# Altium project fitkit4.PrjPcb (part 2 of 2)

## Sheet mcu_headers.SchDoc
size A4
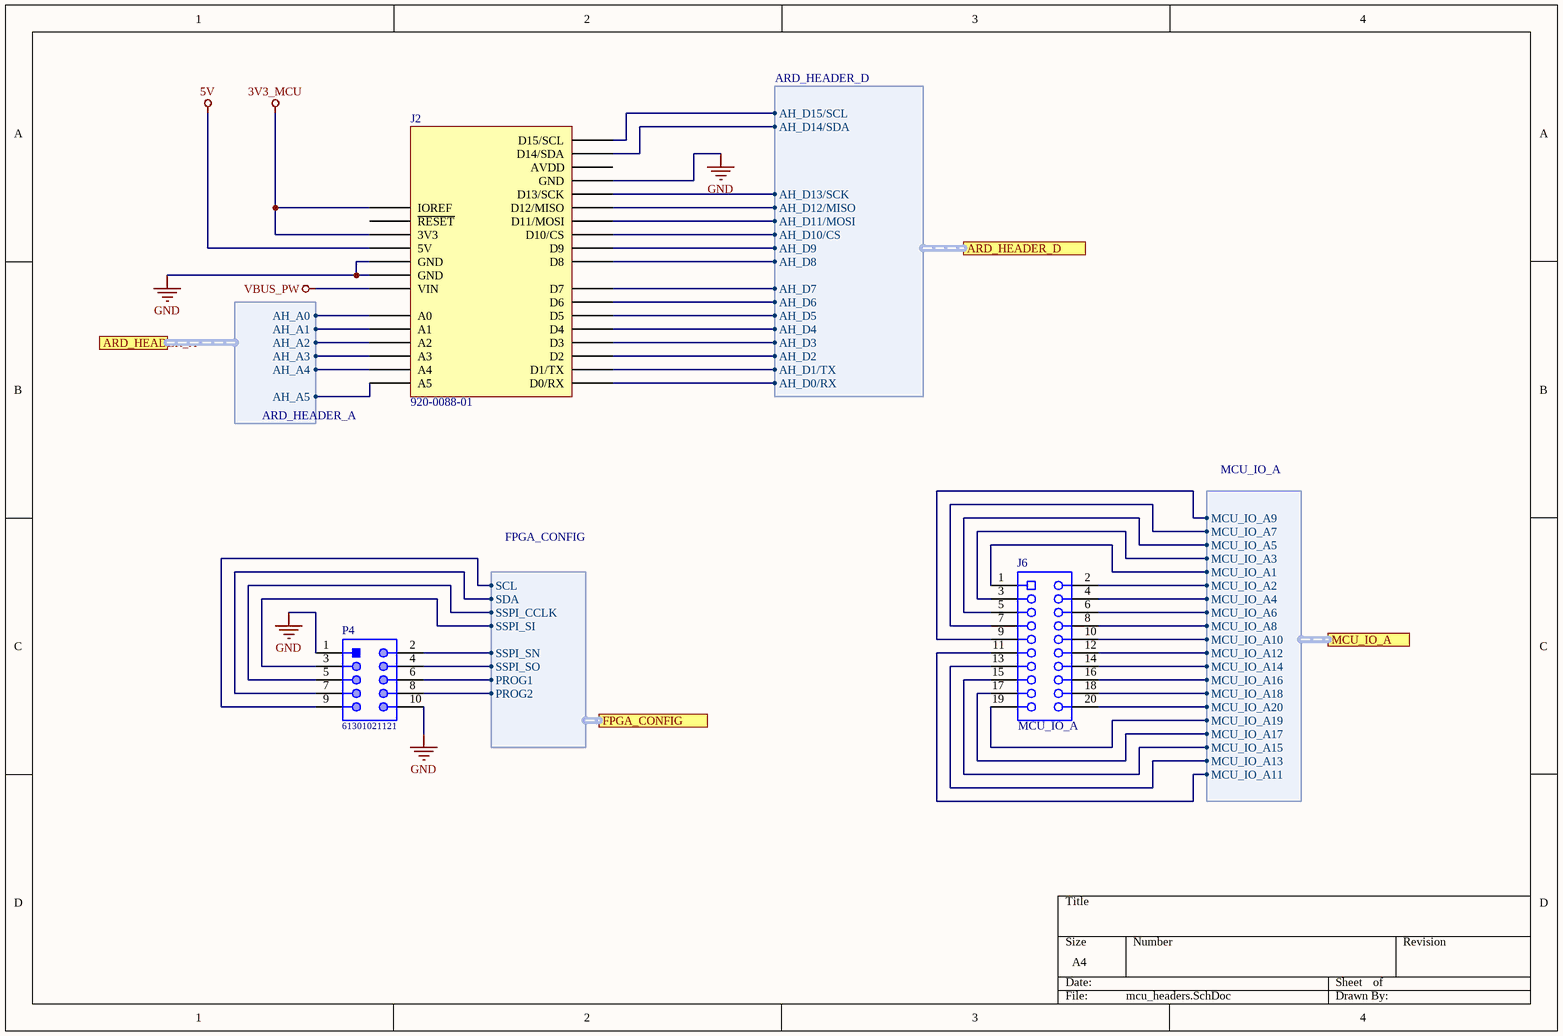
[diagram p5: mcu_headers.SchDoc]

### Parts
J2  920-0088-01  [SCHMARTBOARD - 920-0088-01]
J6  MCU_IO_A  [SLIN-PPPC102LFBN-RC_V]
P4  61301021121  [61301021121]

### Ports
ARD_HEADER_A (harness ARD_HEADER_A), ARD_HEADER_D (harness ARD_HEADER_D), FPGA_CONFIG (harness FPGA_CONFIG), MCU_IO_A (harness MCU_IO_A)

### Harnesses
ARD_HEADER_D: AH_D15/SCL, AH_D14/SDA, AH_D13/SCK, AH_D12/MISO, AH_D11/MOSI, AH_D10/CS, AH_D9, AH_D8, AH_D7, AH_D5, AH_D4, AH_D3, AH_D2, AH_D1/TX, AH_D0/RX, AH_D6
MCU_IO_A: MCU_IO_A9, MCU_IO_A7, MCU_IO_A5, MCU_IO_A3, MCU_IO_A1, MCU_IO_A2, MCU_IO_A4, MCU_IO_A6, MCU_IO_A8, MCU_IO_A10, MCU_IO_A12, MCU_IO_A14, MCU_IO_A16, MCU_IO_A18, MCU_IO_A20, MCU_IO_A19, MCU_IO_A17, MCU_IO_A15, MCU_IO_A13, MCU_IO_A11
FPGA_CONFIG: SSPI_SN, SSPI_SO, PROG1, PROG2, SSPI_SI, SSPI_CCLK, SDA, SCL
ARD_HEADER_A: AH_A0, AH_A1, AH_A2, AH_A3, AH_A4, AH_A5

### Nets
3V3_MCU: J2.2(IOREF) J2.4(3V3)
5V: J2.5(5V) J2.8(VIN)  [also labelled VBUS_PW]
GND: J2.6(GND) J2.7(GND) J2.29(GND) P4.1 P4.10
A10: J6.10 ; port MCU_IO_A.MCU_IO_A10
A11: J6.11 ; port MCU_IO_A.MCU_IO_A11
A12: J6.12 ; port MCU_IO_A.MCU_IO_A12
A13: J6.13 ; port MCU_IO_A.MCU_IO_A13
A14: J6.14 ; port MCU_IO_A.MCU_IO_A14
A15: J6.15 ; port MCU_IO_A.MCU_IO_A15
A16: J6.16 ; port MCU_IO_A.MCU_IO_A16
A17: J6.17 ; port MCU_IO_A.MCU_IO_A17
A18: J6.18 ; port MCU_IO_A.MCU_IO_A18
A19: J6.19 ; port MCU_IO_A.MCU_IO_A19
A20: J6.20 ; port MCU_IO_A.MCU_IO_A20
NetIC1_P2: J2.10(A1) ; port ARD_HEADER_A.AH_A1
NetIC1_P6: J2.9(A0) ; port ARD_HEADER_A.AH_A0
NetIC1_P37: J2.18(D3) ; port ARD_HEADER_D.AH_D3
NetIC1_P57: J2.20(D5) ; port ARD_HEADER_D.AH_D5
NetIC1_P58: J2.21(D6) ; port ARD_HEADER_D.AH_D6
NetIC1_P60: J2.16(D1/TX) ; port ARD_HEADER_D.AH_D1/TX
NetIC1_P61: J2.15(D0/RX) ; port ARD_HEADER_D.AH_D0/RX
NetIC1_P62: J2.22(D7) ; port ARD_HEADER_D.AH_D7
NetIC1_P63: J2.24(D9) ; port ARD_HEADER_D.AH_D9
NetIC1_P64: J2.17(D2) ; port ARD_HEADER_D.AH_D2
NetIC1_P66: J2.19(D4) ; port ARD_HEADER_D.AH_D4
NetIC1_P67: J2.23(D8) ; port ARD_HEADER_D.AH_D8
NetIC1_P68: P4.8 ; port FPGA_CONFIG.PROG2
NetIC1_P69: J6.1 ; port MCU_IO_A.MCU_IO_A1
NetIC1_P70: P4.6 ; port FPGA_CONFIG.PROG1
NetIC1_P72: J6.2 ; port MCU_IO_A.MCU_IO_A2
NetIC1_P75: J6.3 ; port MCU_IO_A.MCU_IO_A3
NetIC1_P81: J6.4 ; port MCU_IO_A.MCU_IO_A4
NetIC1_P84: J6.5 ; port MCU_IO_A.MCU_IO_A5
NetIC1_P87: J6.6 ; port MCU_IO_A.MCU_IO_A6
NetIC1_P88: J6.7 ; port MCU_IO_A.MCU_IO_A7
NetIC1_P91: J6.8 ; port MCU_IO_A.MCU_IO_A8
NetIC1_P92: J2.32(D15/SCL) P4.9 ; port ARD_HEADER_D.AH_D15/SCL, port FPGA_CONFIG.SCL
NetIC1_P93: J2.31(D14/SDA) P4.7 ; port ARD_HEADER_D.AH_D14/SDA, port FPGA_CONFIG.SDA
NetIC1_P95: J6.9 ; port MCU_IO_A.MCU_IO_A9
NetIC1_P114: P4.2 ; port FPGA_CONFIG.SSPI_SN
NetIC1_P116: J2.25(D10/CS) ; port ARD_HEADER_D.AH_D10/CS
NetIC1_P118: J2.28(D13/SCK) P4.5 ; port ARD_HEADER_D.AH_D13/SCK, port FPGA_CONFIG.SSPI_CCLK
NetIC1_P122: J2.27(D12/MISO) P4.4 ; port ARD_HEADER_D.AH_D12/MISO, port FPGA_CONFIG.SSPI_SO
NetIC1_P123: J2.26(D11/MOSI) P4.3 ; port ARD_HEADER_D.AH_D11/MOSI, port FPGA_CONFIG.SSPI_SI
NetIC1_P138: J2.13(A4) ; port ARD_HEADER_A.AH_A4
NetIC1_P139: J2.12(A3) ; port ARD_HEADER_A.AH_A3
NetIC1_P143: J2.11(A2) ; port ARD_HEADER_A.AH_A2
NetIC1_P144: J2.14(A5) ; port ARD_HEADER_A.AH_A5

Not connected (* = marked no-connect by the designer): J2 3(~{RESET}) 30(AVDD)

### Library data of the parts
J2 = 920-0088-01: CONN HDR 8/10P 0.1 GOLD PCB 6PC; Manufacturer: Schmartboard, Inc.; Connector Type: Header; Contact Length - Post: 0.413" (10.50mm); Number of Positions: 6, 8, 10; Number of Positions Loaded: All; Pitch - Mating: 0.100" (2.54mm); Style: Board to Board; Part Number: 920-0088-01; ComponentLink1Description: Datasheet; ComponentLink1URL: http://schmartboard.com/content/Brochures/920-0088-01.pdf; ComponentLink2Description: DigiKey Link; ComponentLink2URL: http://digikey.com/product-detail/en/schmartboard-inc/920-0088-01/1988-1036-ND/9559319; Contact Finish - Mating: Gold; Contact Finish - Post: Gold; Contact Type: Female Socket; Fastening Type: Push-Pull; Insulation Color: Black; Insulation Height: 0.335" (8.51mm); LastUpdated: 31.01.2020 20:49:58; Lifecycle Status: Active; Minimum Order: 1; Mounting Type: Through Hole; Number of Rows: 1; Packaging: Bulk; Part Status: Active; Price: 5.00; Series: -; Supplier 1: DigiKey; Supplier Part Number 1: 1988-1036-ND; Termination: Solder
J6 = CMP-1770-00003-1: Female Header, Pitch 2.54 mm, 2 x 10 Position, Height 8.75 mm, Tail Length 3.2 mm, -40 to 105 degC, RoHS, Bulk; Max Supply Voltage: 16 V; Frequency: 100 KHz; Case\Package: SOIC; Min Supply Voltage: 4.5 V; Max Ouput Current: -200 mA; Package Quantity: 2500; ComponentLink1Description: Datasheet; Min Operating Temperature: 0 degC; Pins: 8; Weight: 0.002561 oz; Radiation Hardening: No; Mount: Surface Mount; Width: 3.91 mm; RoHSCompliant: true; ComponentLink1URL: http://datasheet.octopart.com/PPPC102LFBN-RC-Sullins-datasheet-8327184.pdf; DatasheetVersion: Rev. D, 10/2007; Max Operating Temperature: 70 degC; Height: 1.58 mm; Length: 4.9 mm; PackageReference: PPPC102LFBN-RC; Packaging: Tape and Reel; REACH SVHC: No SVHC; PackageDescription: Female Header, Pitch 2.54 mm, 2 x 10 Position, Height 8.75 mm, Tail Length 3.2 mm
P4 = CMP-1502-01084-1: THT Vertical Pin Header WR-PHD, Pitch 2.54 mm, Dual Row, 10 pins; Manufacturer: Wurth Elektronik; Working Voltage: 250VAC; Pitch: 2.54mm; Contact Resistance: 20mOhm; Gender: Male; Rated Current: 3A; Withstanding Voltage: 500VAC; Pin Number: 10; Operating Temperature: -40to105degC; Mounting Technology: THT; Publisher: WurthElektronik; Manufacturer URL: http://www.we-online.de; Part Number: 61301021121; Row Number: Dual; Packaging: Bag; Orientation: Vertical; Package Reference: 61301021121; Datasheet URL: https://katalog.we-online.de/em/datasheet/6130xx21121.pdf

## Sheet mcu_io.SchDoc
size A4
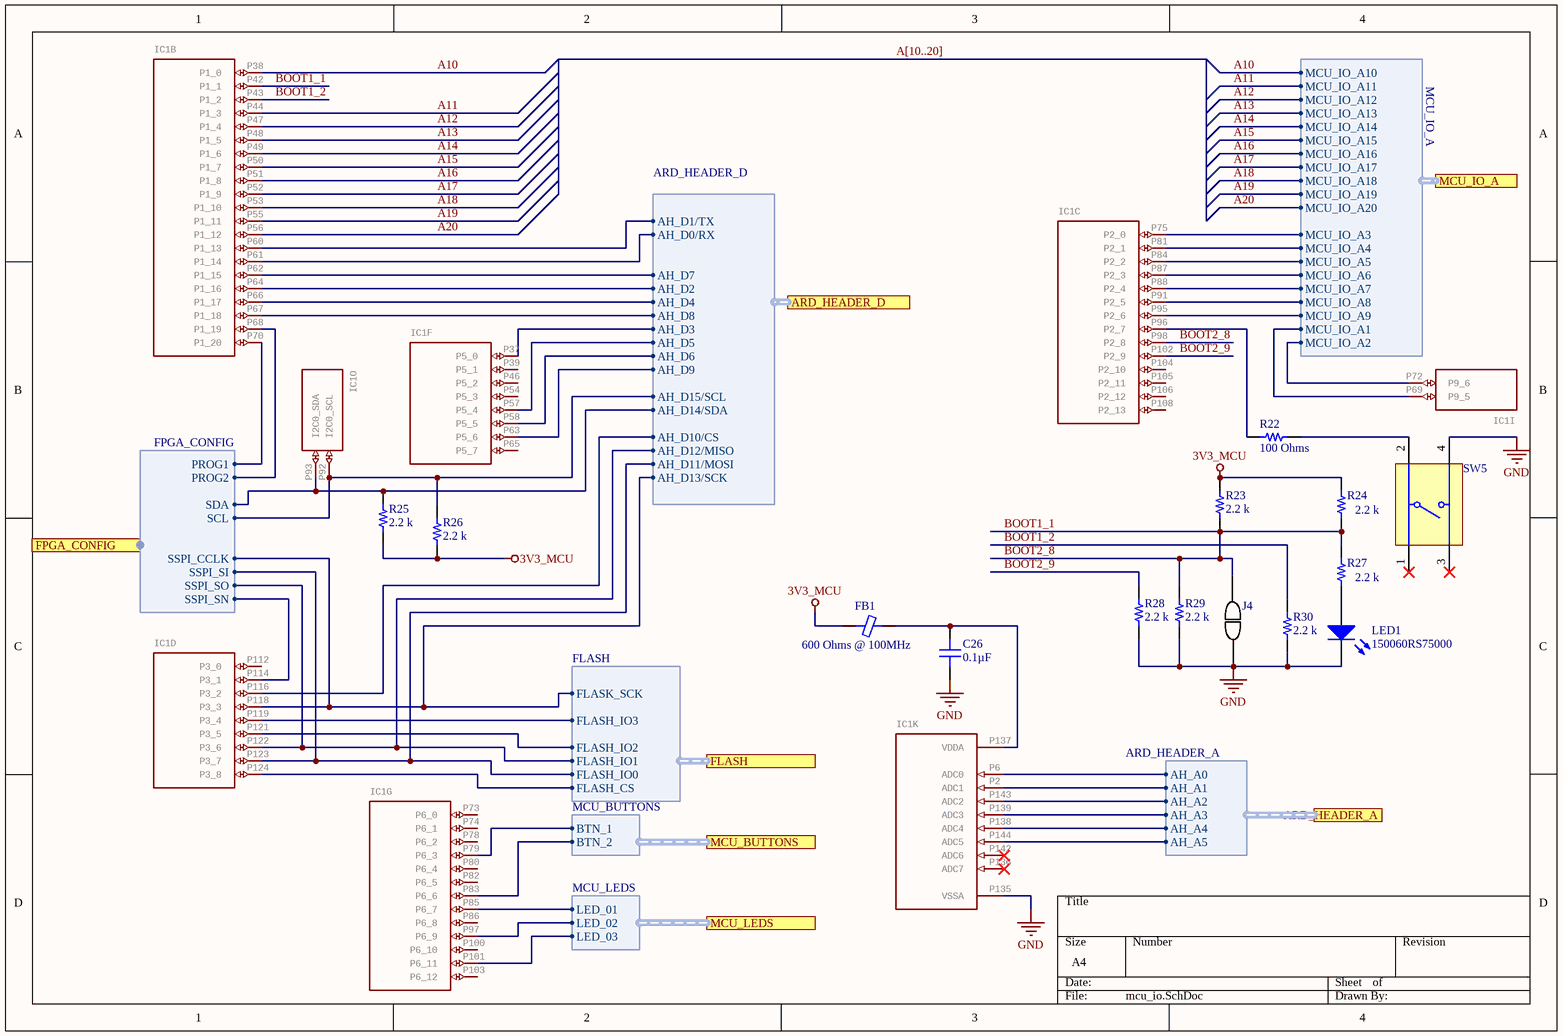
[diagram p6: mcu_io.SchDoc]

### Parts
C26  0.1µF  [CAP 0603_1608]
FB1  600 Ohms @ 100MHz  [FER 0603_1608]
IC1  LQFP144 - SOT486-1    LQFP144: plastic low profile quad flat package; 144 leads; body 20 x 20 x 1.4 mm    body + leads 22 x 22 mm   Solderland (pads) 0.4 x 1.5 mm on corners (8 x) and 0.28 x 1.5 mm (136 x)  [LQFP144]  (value not drawn)  (parts B,C,D,F,G,I,K,O of 17)
J4  103185-2  [TE_103185-2]  (value not drawn)
LED1  150060RS75000  [0603_A]
R22  100 Ohms  [RES 0603_1608]
R23  2.2 k  [RES 0603_1608]
R24  2.2 k  [RES 0603_1608]
R25  2.2 k  [RES 0603_1608]
R26  2.2 k  [RES 0603_1608]
R27  2.2 k  [RES 0603_1608]
R28  2.2 k  [RES 0603_1608]
R29  2.2 k  [RES 0603_1608]
R30  2.2 k  [RES 0603_1608]
SW5  FSM4JSMATR  [TECO-FSM4JSMATR_V]  (value not drawn)

### Ports
ARD_HEADER_A (harness ARD_HEADER_A), ARD_HEADER_D (harness ARD_HEADER_D), FLASH (harness FLASH), FPGA_CONFIG (harness FPGA_CONFIG), MCU_BUTTONS (harness MCU_BUTTONS), MCU_IO_A (harness MCU_IO_A), MCU_LEDS (harness MCU_LEDS)

### Harnesses
FLASH: FLASH_CS, FLASH_IO0, FLASH_IO1, FLASH_IO2, FLASH_IO3, FLASK_SCK
ARD_HEADER_D: AH_D0/RX, AH_D1/TX, AH_D10/CS, AH_D11/MOSI, AH_D12/MISO, AH_D13/SCK, AH_D14/SDA, AH_D15/SCL, AH_D2, AH_D3, AH_D4, AH_D5, AH_D6, AH_D7, AH_D8, AH_D9
FPGA_CONFIG: PROG1, PROG2, SCL, SDA, SSPI_CCLK, SSPI_SI, SSPI_SN, SSPI_SO
MCU_BUTTONS: BTN_1, BTN_2
MCU_LEDS: LED_01, LED_02, LED_03
MCU_IO_A: MCU_IO_A1, MCU_IO_A10, MCU_IO_A11, MCU_IO_A12, MCU_IO_A13, MCU_IO_A14, MCU_IO_A15, MCU_IO_A16, MCU_IO_A17, MCU_IO_A18, MCU_IO_A19, MCU_IO_A2, MCU_IO_A20, MCU_IO_A3, MCU_IO_A4, MCU_IO_A5, MCU_IO_A6, MCU_IO_A7, MCU_IO_A8, MCU_IO_A9
ARD_HEADER_A: AH_A0, AH_A1, AH_A2, AH_A3, AH_A4, AH_A5

### Nets
3V3_MCU: FB1.1 R23.2 R24.2 R25.2 R26.2
GND: C26.1 IC1.P135(VSSA) J4.1 LED1.1(K) R28.1 R29.1 R30.1 SW5.4
A10: IC1.P38(P1_0) ; port MCU_IO_A.MCU_IO_A10
A11: IC1.P44(P1_3) ; port MCU_IO_A.MCU_IO_A11
A12: IC1.P47(P1_4) ; port MCU_IO_A.MCU_IO_A12
A13: IC1.P48(P1_5) ; port MCU_IO_A.MCU_IO_A13
A14: IC1.P49(P1_6) ; port MCU_IO_A.MCU_IO_A14
A15: IC1.P50(P1_7) ; port MCU_IO_A.MCU_IO_A15
A16: IC1.P51(P1_8) ; port MCU_IO_A.MCU_IO_A16
A17: IC1.P52(P1_9) ; port MCU_IO_A.MCU_IO_A17
A18: IC1.P53(P1_10) ; port MCU_IO_A.MCU_IO_A18
A19: IC1.P55(P1_11) ; port MCU_IO_A.MCU_IO_A19
A20: IC1.P56(P1_12) ; port MCU_IO_A.MCU_IO_A20
BOOT1_1: IC1.P42(P1_1) IC1.P98(P2_8) J4.2 R23.1 R24.1 R27.2 R29.2  [also labelled BOOT2_8]
BOOT1_2: IC1.P43(P1_2) R30.2
BOOT2_9: IC1.P102(P2_9) R28.2
NetC26_2: C26.2 FB1.2 IC1.P137(VDDA)
NetD5_2: IC1.P85(P6_7) ; port MCU_LEDS.LED_01
NetD6_2: IC1.P97(P6_9) ; port MCU_LEDS.LED_02
NetD7_2: IC1.P101(P6_11) ; port MCU_LEDS.LED_03
NetIC1_P2: IC1.P2(ADC1) ; port ARD_HEADER_A.AH_A1
NetIC1_P6: IC1.P6(ADC0) ; port ARD_HEADER_A.AH_A0
NetIC1_P37: IC1.P37(P5_0) ; port ARD_HEADER_D.AH_D3
NetIC1_P57: IC1.P57(P5_4) ; port ARD_HEADER_D.AH_D5
NetIC1_P58: IC1.P58(P5_5) ; port ARD_HEADER_D.AH_D6
NetIC1_P60: IC1.P60(P1_13) ; port ARD_HEADER_D.AH_D1/TX
NetIC1_P61: IC1.P61(P1_14) ; port ARD_HEADER_D.AH_D0/RX
NetIC1_P62: IC1.P62(P1_15) ; port ARD_HEADER_D.AH_D7
NetIC1_P63: IC1.P63(P5_6) ; port ARD_HEADER_D.AH_D9
NetIC1_P64: IC1.P64(P1_16) ; port ARD_HEADER_D.AH_D2
NetIC1_P66: IC1.P66(P1_17) ; port ARD_HEADER_D.AH_D4
NetIC1_P67: IC1.P67(P1_18) ; port ARD_HEADER_D.AH_D8
NetIC1_P68: IC1.P68(P1_19) ; port FPGA_CONFIG.PROG2
NetIC1_P69: IC1.P69(P9_5) ; port MCU_IO_A.MCU_IO_A1
NetIC1_P70: IC1.P70(P1_20) ; port FPGA_CONFIG.PROG1
NetIC1_P72: IC1.P72(P9_6) ; port MCU_IO_A.MCU_IO_A2
NetIC1_P75: IC1.P75(P2_0) ; port MCU_IO_A.MCU_IO_A3
NetIC1_P79: IC1.P79(P6_3) ; port MCU_BUTTONS.BTN_1
NetIC1_P81: IC1.P81(P2_1) ; port MCU_IO_A.MCU_IO_A4
NetIC1_P83: IC1.P83(P6_6) ; port MCU_BUTTONS.BTN_2
NetIC1_P84: IC1.P84(P2_2) ; port MCU_IO_A.MCU_IO_A5
NetIC1_P87: IC1.P87(P2_3) ; port MCU_IO_A.MCU_IO_A6
NetIC1_P88: IC1.P88(P2_4) ; port MCU_IO_A.MCU_IO_A7
NetIC1_P91: IC1.P91(P2_5) ; port MCU_IO_A.MCU_IO_A8
NetIC1_P92: IC1.P92(I2C0_SCL) R26.1 ; port ARD_HEADER_D.AH_D15/SCL, port FPGA_CONFIG.SCL
NetIC1_P93: IC1.P93(I2C0_SDA) R25.1 ; port ARD_HEADER_D.AH_D14/SDA, port FPGA_CONFIG.SDA
NetIC1_P95: IC1.P95(P2_6) ; port MCU_IO_A.MCU_IO_A9
NetIC1_P96: IC1.P96(P2_7) R22.1
NetIC1_P114: IC1.P114(P3_1) ; port FPGA_CONFIG.SSPI_SN
NetIC1_P116: IC1.P116(P3_2) ; port ARD_HEADER_D.AH_D10/CS
NetIC1_P118: IC1.P118(P3_3) ; port FLASH.FLASK_SCK, port ARD_HEADER_D.AH_D13/SCK, port FPGA_CONFIG.SSPI_CCLK
NetIC1_P119: IC1.P119(P3_4) ; port FLASH.FLASH_IO3
NetIC1_P121: IC1.P121(P3_5) ; port FLASH.FLASH_IO2
NetIC1_P122: IC1.P122(P3_6) ; port FLASH.FLASH_IO1, port ARD_HEADER_D.AH_D12/MISO, port FPGA_CONFIG.SSPI_SO
NetIC1_P123: IC1.P123(P3_7) ; port FLASH.FLASH_IO0, port ARD_HEADER_D.AH_D11/MOSI, port FPGA_CONFIG.SSPI_SI
NetIC1_P124: IC1.P124(P3_8) ; port FLASH.FLASH_CS
NetIC1_P138: IC1.P138(ADC4) ; port ARD_HEADER_A.AH_A4
NetIC1_P139: IC1.P139(ADC3) ; port ARD_HEADER_A.AH_A3
NetIC1_P143: IC1.P143(ADC2) ; port ARD_HEADER_A.AH_A2
NetIC1_P144: IC1.P144(ADC5) ; port ARD_HEADER_A.AH_A5
NetLED1_2: LED1.2(A) R27.1
NetR22_2: R22.2 SW5.2

Not connected (* = marked no-connect by the designer): IC1 P39(P5_1) P46(P5_2) P54(P5_3) P65(P5_7) P73(P6_0) P74(P6_1) P78(P6_2) P80(P6_4) P82(P6_5) P86(P6_8) P100(P6_10) P103(P6_12) P104(P2_10) P105(P2_11) P106(P2_12) P108(P2_13) P112(P3_0) P136(ADC7)* P142(ADC6)*; SW5 1* 3*

### Buses and harness runs
bus A[10..20]

### Library data of the parts
C26 = C0603C104K5RAC7411: CAP CER 0.1UF 50V X7R 0603; Manufacturer: KEMET; Tolerance: ±10%; Part Number: C0603C104K5RAC7411; Value: 0.1µF; Applications: Bypass, Decoupling; Capacitance: 0.1µF; ComponentLink1Description: Datasheet; ComponentLink1URL: https://api.kemet.com/component-edge/download/datasheet/C0603C104K5RAC7411.pdf; ComponentLink2Description: DigiKey Link; ComponentLink2URL: http://digikey.com/product-detail/en/kemet/C0603C104K5RAC7411/399-7374-2-ND/3317013; Device Package: 0603 (1608 Metric); LastUpdated: 02.09.2020 1:03:36; Lifecycle Status: Active; Minimum Order: 15000; Mounting Type: Surface Mount, MLCC; Operating Temperature: -55°C ~ 125°C; Package / Case: 0603 (1608 Metric); Packaging: TapeAndReel; PartId: 2233; Part Status: Active; Price: 0.02; Series: SMD Comm X7R; Size / Dimension: 0.063" L x 0.031" W (1.60mm x 0.80mm); Supplier 1: DigiKey; Supplier Part Number 1: 399-7374-2-ND; Temperature Coefficient: X7R; Thickness (Max): 0.035" (0.90mm); Voltage - Rated: 50V
FB1 = BLM18AG601SN1D: FERRITE BEAD 600 OHM 0603 1LN; Manufacturer: Murata Electronics; Current Rating (Max): 500mA; DC Resistance (DCR) (Max): 380mOhm; Number of Lines: 1; Part Number: BLM18AG601SN1D; ComponentLink1Description: Datasheet; ComponentLink1URL: https://www.murata.com/en-us/products/productdata/8796738650142/ENFA0003.pdf; ComponentLink2Description: DigiKey Link; ComponentLink2URL: http://digikey.com/product-detail/en/murata-electronics/BLM18AG601SN1D/490-1014-1-ND/584462; Device Package: 0603 (1608 Metric); Height (Max): 0.037" (0.95mm); Impedance @ Frequency: 600 Ohms @ 100MHz; LastUpdated: 02.09.2020 1:18:18; Lifecycle Status: Active; Minimum Order: 1; Mounting Type: Surface Mount; Operating Temperature: -55°C ~ 125°C; Package / Case: 0603 (1608 Metric); Packaging: TapeAndReel; PartId: 848; Part Status: Active; Price: 0.02; Series: EMIFIL®, BLM18; Size / Dimension: 0.063" L x 0.032" W (1.60mm x 0.80mm); Supplier 1: DigiKey; Supplier Part Number 1: 490-1014-1-ND; Value: 600 Ohms @ 100MHz
IC1 = LPC4300_LQFP144: GateName_1: G$1; SymbolName_1: 144_0_PORT0; GateName_2: G$2; SymbolName_2: 144_1_PORT1; GateName_3: G$3; SymbolName_3: 144_2_PORT2; GateName_4: G$4; SymbolName_4: 144_3_PORT3; GateName_5: G$5; SymbolName_5: 144_4_PORT4; GateName_6: G$6; SymbolName_6: 144_5_PORT5; GateName_7: G$7; SymbolName_7: 144_6_PORT6; GateName_8: G$8; SymbolName_8: 144_7_PORT7; GateName_9: G$9; SymbolName_9: 144_9_PORT9; GateName_10: G$10; SymbolName_10: 144_15_PORTF; GateName_11: G$11; SymbolName_11: 144_16_ANA; GateName_12: G$12; SymbolName_12: 144_17_RTC; GateName_13: G$13; SymbolName_13: 144_18_CLK; GateName_14: G$14; SymbolName_14: 144_19_DBUG; GateName_15: G$15; SymbolName_15: 144_20_I2C; GateName_16: G$16; SymbolName_16: 144_21_SUP; GateName_17: G$17; SymbolName_17: 144_22_USB; LibraryName: LPC4300; DeviceSetName: LPC4300_LQFP144; Package: LQFP144
J4 = 103185-2: 02 MODII HDR SRST B/A .100CL; Package: None; Price: None; Value: *; MP: 103185-2; Availability: Unavailable
LED1 = CMP-1426-00001-1: SMD mono-color Chip LED, WL-SMCW, Red; Manufacturer: Wuerth Elektronik; Color: Red; PackageReference: 0603_A; ComponentLink2URL: http://katalog.we-online.com/led/datasheet/150060RS75000.pdf; ComponentLink1URL: http://www.we-online.com; ComponentLink1Description: Manufacturer URL; ComponentLink2Description: Datasheet; PartNumber: 150060RS75000
R22 = RNCS0603BKE100R: RES 100 OHM 0.1% 1/16W 0603; Manufacturer: Stackpole Electronics Inc; Power (Watts): 0.063W, 1/16W; Temperature Coefficient: ±25ppm/°C; Part Number: RNCS0603BKE100R; Value: 100 Ohms; ComponentLink1Description: Datasheet; ComponentLink1URL: https://www.seielect.com/catalog/sei-rncs_rnch.pdf; ComponentLink2Description: DigiKey Link; ComponentLink2URL: http://digikey.com/product-detail/en/stackpole-electronics-inc/RNCS0603BKE100R/RNCS0603BKE100RCT-ND/1800117; Composition: Thin Film; Device Package: 0603 (1608 Metric); Features: Anti-Corrosive, Automotive AEC-Q200, Moisture Resistant; Height - Seated (Max): 0.022" (0.55mm); LastUpdated: 02.09.2020 1:10:25; Lifecycle Status: Active; Minimum Order: 1; Number of Terminations: 2; Operating Temperature: -55°C ~ 155°C; Package / Case: 0603 (1608 Metric); Packaging: TapeAndReel; PartId: 4839; Part Status: Active; Price: 0.08; Ratings: AEC-Q200; Resistance: 100 Ohms; Series: RNCS; Size / Dimension: 0.061" L x 0.031" W (1.55mm x 0.80mm); Supplier 1: DigiKey; Supplier Part Number 1: RNCS0603BKE100RCT-ND; Supplier Device Package: 0603; Tolerance: ±0.1%
R23 R24 R27-R30 = ERJ-3EKF2201V: RES SMD 2.2K OHM 1% 1/10W 0603; Manufacturer: Panasonic Electronic Components; Power (Watts): 0.1W, 1/10W; Resistance: 2.2 kOhms; Temperature Coefficient: ±100ppm/°C; Part Number: ERJ-3EKF2201V; Value: 2.2 k; ComponentLink1Description: Datasheet; ComponentLink1URL: https://industrial.panasonic.com/cdbs/www-data/pdf/RDA0000/AOA0000C304.pdf; ComponentLink2Description: DigiKey Link; ComponentLink2URL: http://digikey.com/product-detail/en/panasonic-electronic-components/ERJ-3EKF2201V/P2.20KHCT-ND/1746742; Composition: Thick Film; Device Package: 0603 (1608 Metric); Features: Automotive AEC-Q200; Height - Seated (Max): 0.022" (0.55mm); LastUpdated: 02.09.2020 1:10:23; Lifecycle Status: Active; Minimum Order: 1; Number of Terminations: 2; Operating Temperature: -55°C ~ 155°C; Package / Case: 0603 (1608 Metric); Packaging: TapeAndReel; PartId: 5643; Part Status: Active; Price: 0.01; Ratings: AEC-Q200; Series: ERJ; Size / Dimension: 0.063" L x 0.031" W (1.60mm x 0.80mm); Supplier 1: DigiKey; Supplier Part Number 1: P2.20KHCT-ND; Supplier Device Package: 0603; Tolerance: ±1%
R25 R26 = RK73B1JTTD222J: RES 2.2K OHM 5% 1/10W 0603; Manufacturer: KOA Speer Electronics, Inc.; Power (Watts): 0.1W, 1/10W; Resistance: 2.2 kOhms; Temperature Coefficient: ±200ppm/°C; Part Number: RK73B1JTTD222J; Value: 2.2 k; ComponentLink1Description: Datasheet; ComponentLink1URL: http://www.koaspeer.com/catimages/Products/RK73B/RK73B.pdf; ComponentLink2Description: DigiKey Link; ComponentLink2URL: http://digikey.com/product-detail/en/koa-speer-electronics-inc/RK73B1JTTD222J/2019-RK73B1JTTD222JCT-ND/9846749; Composition: Thick Film; Device Package: 0603 (1608 Metric); Features: Automotive AEC-Q200, Moisture Resistant; Height - Seated (Max): 0.022" (0.55mm); LastUpdated: 02.09.2020 1:10:23; Lifecycle Status: Active; Minimum Order: 1; Number of Terminations: 2; Operating Temperature: -55°C ~ 155°C; Package / Case: 0603 (1608 Metric); Packaging: CutTape; PartId: 5855; Part Status: Active; Price: 0.10; Ratings: AEC-Q200; Series: RK73B; Size / Dimension: 0.063" L x 0.031" W (1.60mm x 0.80mm); Supplier 1: DigiKey; Supplier Part Number 1: 2019-RK73B1JTTD222JCT-ND; Supplier Device Package: 0603; Tolerance: ±5%
SW5 = CMP-2000-07486-1: Micro Miniature Push Button Switch FSM JSM, 50 mA, -35 to 85 degC, 4-Pin SMD, RoHS, Tape and Reel; Manufacturer: TE Connectivity; Mechanical Life: 100000Cycles; Current Rating: 50mA; Actuator Material: Polyamide; Max Voltage Rating (DC): 12V; Capacitance: 0f; Illumination Type: Illuminated; Voltage Rating (DC): 24V; Case\/Package: SMD/SMT; Operating Force: 160gf; Contact Resistance: 100mOhm; Actuator Length: 0.055inch; Switch Travel: 0.25mm; Throw Configuration: SPST; Termination: GullWing; Contact Plating: Silver; Orientation: Straight; Mounting Technology: SurfaceMount; REACH SVHC: Unknown; Electrical Life: 100000Cycles; Package Reference: FSM4JSMATR; Max Operating Temperature: 85degC; Manufacturer URL: http://www.te.com/; Package Description: 4-Pin Surface Mount Device, Body 6 x 6 mm, Pitch 4.5 mm; Datasheet Version: Rev. V, 02/2015; Packaging: TapeandReel; Min Operating Temperature: -35degC; Mount: SurfaceMount; Contact Current Rating: 50mA; Contact Material: CopperAlloy; Package Quantity: 1200; Datasheet URL: http://www.te.com/commerce/DocumentDelivery/DDEController?Action=showdoc&DocId=Customer+Drawing%7F2-1437565-7%7FV%7Fpdf%7FEnglish%7FENG_CD_2-1437565-7_V.pdf%7F4-1437565-2; RoHSCompliant: true

## Nets that join several sheets
3V3_DEBUG: mcu_debug (9 pins), mcu_power (C16.2 U1.5)
3V3_MCU: mcu_core (32 pins), mcu_peripheral (7 pins), mcu_power (C18.2 U2.5 U2.6), mcu_headers (J2.2 J2.4), mcu_io (5 pins)
5V: mcu_core (J1.1), mcu_debug (J3.1), mcu_power (6 pins), mcu_headers (J2.5 J2.8)
GND: mcu_core (33 pins), mcu_debug (11 pins), mcu_peripheral (C25.1 SW3.3 SW4.3 U3.10), mcu_power (7 pins), mcu_headers (5 pins), mcu_io (8 pins)
A10: mcu_headers (J6.10), mcu_io (IC1.P38)
A11: mcu_headers (J6.11), mcu_io (IC1.P44)
A12: mcu_headers (J6.12), mcu_io (IC1.P47)
A13: mcu_headers (J6.13), mcu_io (IC1.P48)
A14: mcu_headers (J6.14), mcu_io (IC1.P49)
A15: mcu_headers (J6.15), mcu_io (IC1.P50)
A16: mcu_headers (J6.16), mcu_io (IC1.P51)
A17: mcu_headers (J6.17), mcu_io (IC1.P52)
A18: mcu_headers (J6.18), mcu_io (IC1.P53)
A19: mcu_headers (J6.19), mcu_io (IC1.P55)
A20: mcu_headers (J6.20), mcu_io (IC1.P56)
NetC11_1: mcu_core (6 pins), mcu_debug (IC2.8)
NetD5_2: mcu_peripheral (D5.2), mcu_io (IC1.P85)
NetD6_2: mcu_peripheral (D6.2), mcu_io (IC1.P97)
NetD7_2: mcu_peripheral (D7.2), mcu_io (IC1.P101)
NetIC1_P2: mcu_headers (J2.10), mcu_io (IC1.P2)
NetIC1_P6: mcu_headers (J2.9), mcu_io (IC1.P6)
NetIC1_P27: mcu_core (IC1.P27 P1.4 R2.1), mcu_debug (IC2.16)
NetIC1_P30: mcu_core (IC1.P30 P1.2), mcu_debug (IC2.17)
NetIC1_P37: mcu_headers (J2.18), mcu_io (IC1.P37)
NetIC1_P57: mcu_headers (J2.20), mcu_io (IC1.P57)
NetIC1_P58: mcu_headers (J2.21), mcu_io (IC1.P58)
NetIC1_P60: mcu_headers (J2.16), mcu_io (IC1.P60)
NetIC1_P61: mcu_headers (J2.15), mcu_io (IC1.P61)
NetIC1_P62: mcu_headers (J2.22), mcu_io (IC1.P62)
NetIC1_P63: mcu_headers (J2.24), mcu_io (IC1.P63)
NetIC1_P64: mcu_headers (J2.17), mcu_io (IC1.P64)
NetIC1_P66: mcu_headers (J2.19), mcu_io (IC1.P66)
NetIC1_P67: mcu_headers (J2.23), mcu_io (IC1.P67)
NetIC1_P68: mcu_headers (P4.8), mcu_io (IC1.P68)
NetIC1_P69: mcu_headers (J6.1), mcu_io (IC1.P69)
NetIC1_P70: mcu_headers (P4.6), mcu_io (IC1.P70)
NetIC1_P72: mcu_headers (J6.2), mcu_io (IC1.P72)
NetIC1_P75: mcu_headers (J6.3), mcu_io (IC1.P75)
NetIC1_P79: mcu_peripheral (R17.1 SW3.2), mcu_io (IC1.P79)
NetIC1_P81: mcu_headers (J6.4), mcu_io (IC1.P81)
NetIC1_P83: mcu_peripheral (R18.1 SW4.2), mcu_io (IC1.P83)
NetIC1_P84: mcu_headers (J6.5), mcu_io (IC1.P84)
NetIC1_P87: mcu_headers (J6.6), mcu_io (IC1.P87)
NetIC1_P88: mcu_headers (J6.7), mcu_io (IC1.P88)
NetIC1_P91: mcu_headers (J6.8), mcu_io (IC1.P91)
NetIC1_P92: mcu_headers (J2.32 P4.9), mcu_io (IC1.P92 R26.1)
NetIC1_P93: mcu_headers (J2.31 P4.7), mcu_io (IC1.P93 R25.1)
NetIC1_P95: mcu_headers (J6.9), mcu_io (IC1.P95)
NetIC1_P114: mcu_headers (P4.2), mcu_io (IC1.P114)
NetIC1_P116: mcu_headers (J2.25), mcu_io (IC1.P116)
NetIC1_P118: mcu_peripheral (U3.16), mcu_headers (J2.28 P4.5), mcu_io (IC1.P118)
NetIC1_P119: mcu_peripheral (U3.1), mcu_io (IC1.P119)
NetIC1_P121: mcu_peripheral (U3.9), mcu_io (IC1.P121)
NetIC1_P122: mcu_peripheral (U3.8), mcu_headers (J2.27 P4.4), mcu_io (IC1.P122)
NetIC1_P123: mcu_peripheral (U3.15), mcu_headers (J2.26 P4.3), mcu_io (IC1.P123)
NetIC1_P124: mcu_peripheral (U3.7), mcu_io (IC1.P124)
NetIC1_P138: mcu_headers (J2.13), mcu_io (IC1.P138)
NetIC1_P139: mcu_headers (J2.12), mcu_io (IC1.P139)
NetIC1_P143: mcu_headers (J2.11), mcu_io (IC1.P143)
NetIC1_P144: mcu_headers (J2.14), mcu_io (IC1.P144)